# EAGLE schematic Red Buggy 2015 (EAGLE 7.2.0)
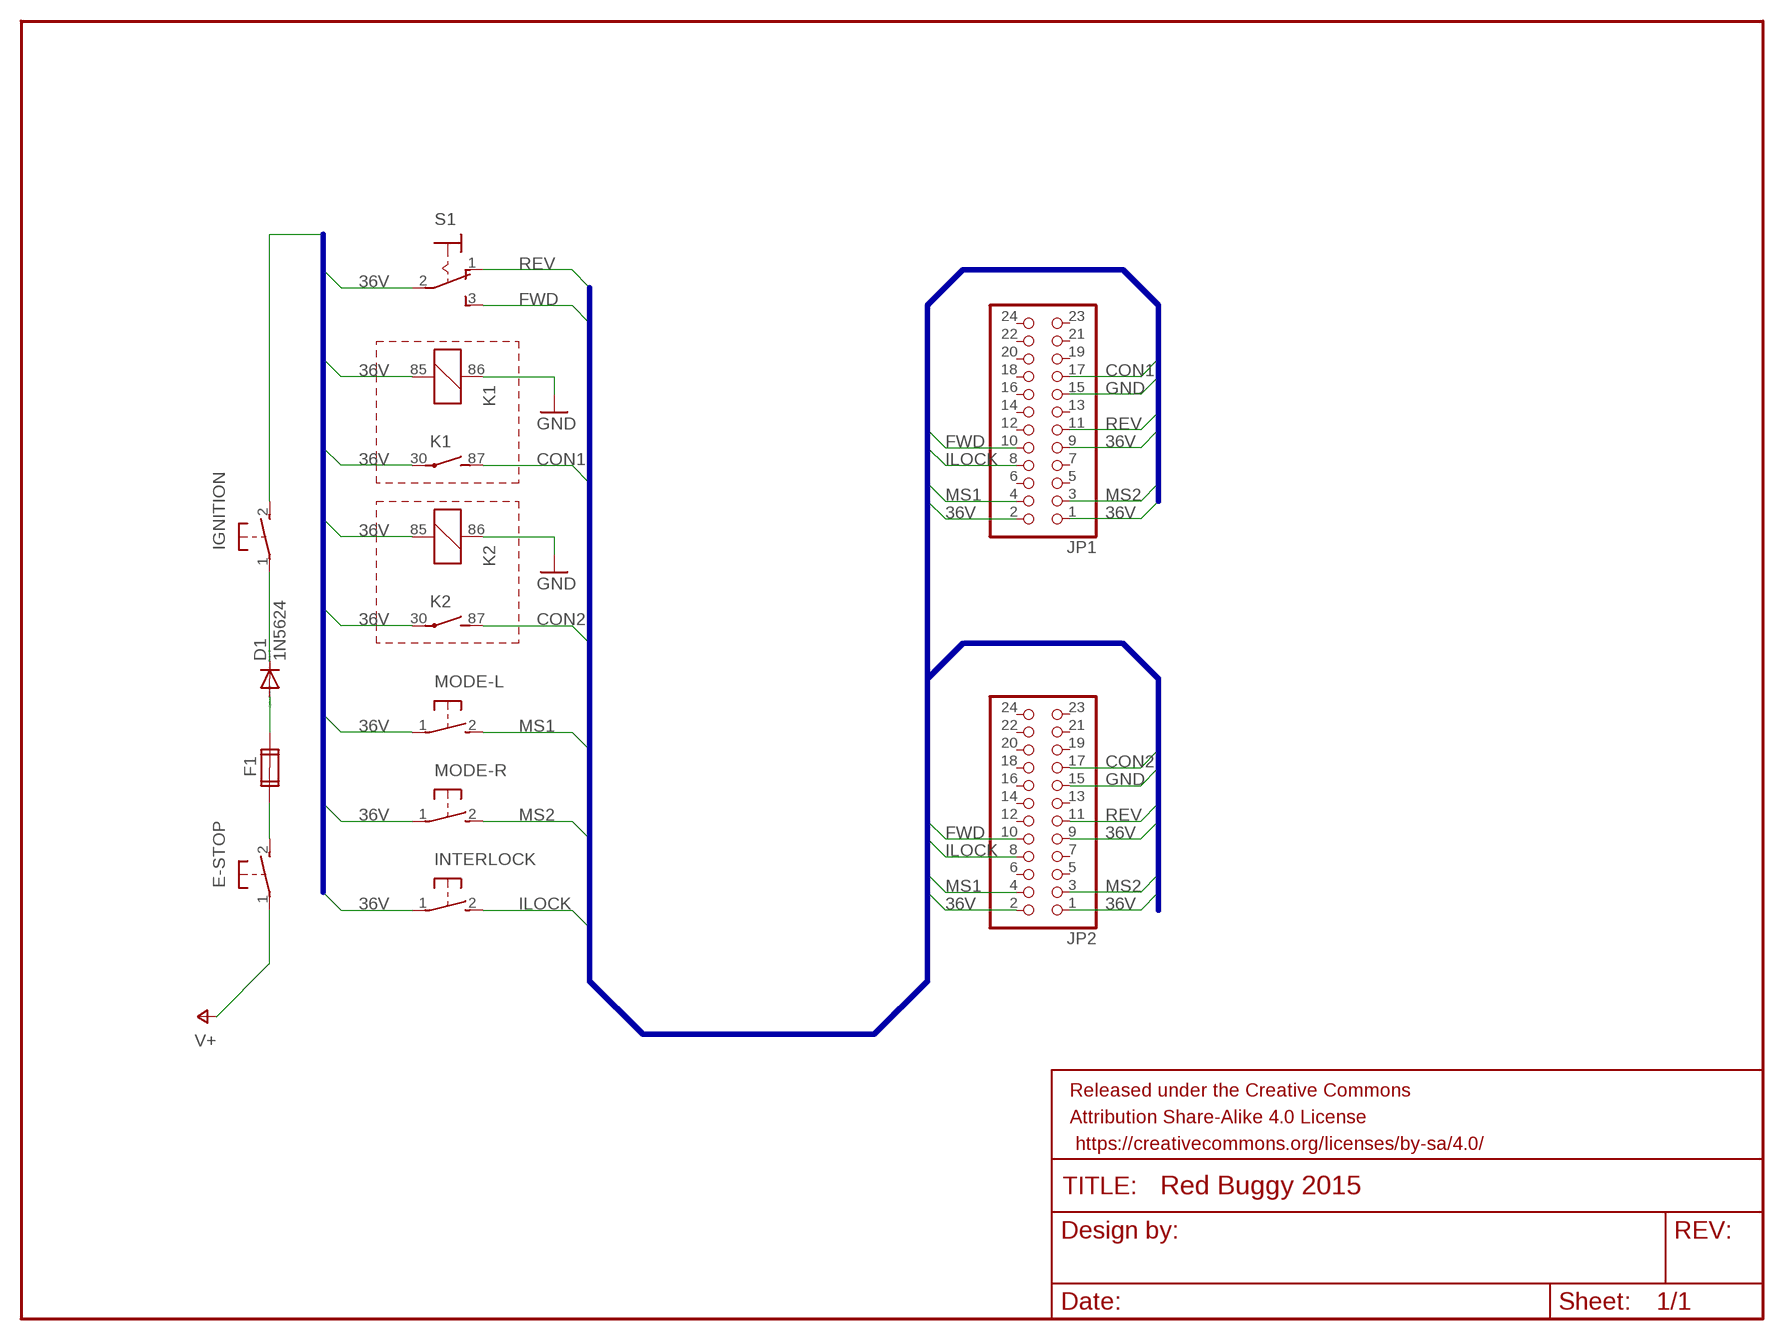
[diagram p0: schematic, sheet 1]

## Parts
D1  1N5624  [DO201-15]
E-STOP  31-XX  [B3F-31XX]
F1  FUSE2P  [FUSE1]
FRAME1  FRAME-LETTER  [CREATIVE_COMMONS]
IGNITION  31-XX  [B3F-31XX]
INTERLOCK  31-XX  [B3F-31XX]
JP1  PINHD-2X12  [2X12]
JP2  PINHD-2X12  [2X12]
K1  CB1A-P-12V  [CB1]
K2  CB1A-P-12V  [CB1]
MODE-L  31-XX  [B3F-31XX]
MODE-R  31-XX  [B3F-31XX]
S1  320-916  [320-916]

## Nets
36V: IGNITION.2(S) INTERLOCK.1(P) JP1.1 JP1.2 JP1.9 JP2.1 JP2.2 JP2.9 K1.30(2:P) K1.85 K2.30(2:P) K2.85 MODE-L.1(P) MODE-R.1(P) S1.2(P)
CON1: JP1.17 K1.87(2:S)
CON2: JP2.17 K2.87(2:S)
FWD: JP1.10 JP2.10 S1.3(S)
GND: JP1.15 JP2.15 K1.86 K2.86
ILOCK: INTERLOCK.2(S) JP1.8 JP2.8
MS1: JP1.4 JP2.4 MODE-L.2(S)
MS2: JP1.3 JP2.3 MODE-R.2(S)
N$1: D1.A F1.2A
N$2: E-STOP.2(S) F1.1A
N$3: D1.C IGNITION.1(P)
REV: JP1.11 JP2.11 S1.1(O)
V+: E-STOP.1(P)
Unconnected: F1.1B F1.2B JP1.5 JP1.6 JP1.7 JP1.12 JP1.13 JP1.14 JP1.16 JP1.18 JP1.19 JP1.20 JP1.21 JP1.22 JP1.23 JP1.24 JP2.5 JP2.6 JP2.7 JP2.12 JP2.13 JP2.14 JP2.16 JP2.18 JP2.19 JP2.20 JP2.21 JP2.22 JP2.23 JP2.24

## Buses
36V
REV,FWD,CON[1..2],MS[1..2],ILOCK,GND,36V

## Library data of the parts
D1 = diode:1N5624: DIODE controlled avalanche rectifier
E-STOP IGNITION INTERLOCK MODE-L MODE-R = adafruit:31-XX: OMRON SWITCH Now with beefier pads!
F1 = special:FUSE2P: FUSE 5 x 20 mm
FRAME1 = SparkFun-Aesthetics:FRAME-LETTER: Schematic Frame Standard 8.5x11 US Letter frame
JP1 JP2 = pinhead:PINHD-2X12: PIN HEADER
K1 K2 = relay:CB*: HIGH POWER AUTOMOTIVE RELAY Form A NAiS Source: http://www.mew-europe.com/.. en_ds_61202_0000.pdf; MF: AROMAT/ MATSUSHITA; MPN: CB1A-P-12V; OC_FARNELL: 1270582; OC_NEWARK: 50B849
S1 = switch:320-916: TOGGLE SWITCH distributor RS Components